# Altium project CoreBoard.PrjPcb
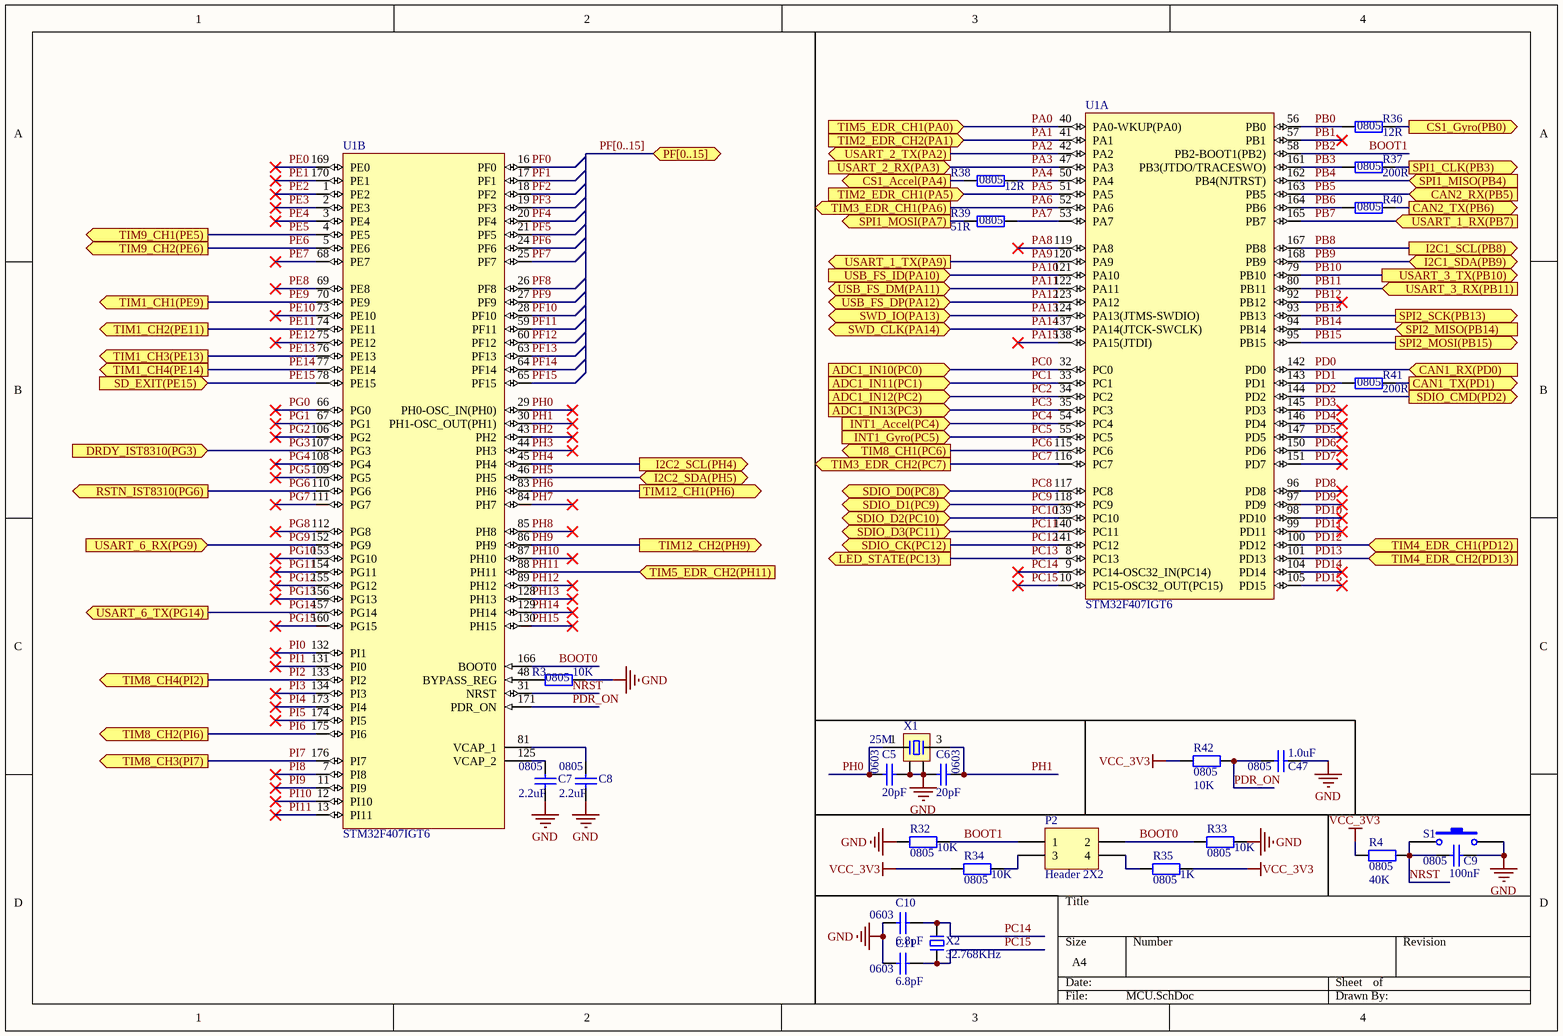
[diagram p0: MCU.SchDoc]
5 sheets, 296 parts. Net scope: flat (ports and power ports of the same name join across sheets).
Board files: coreBoard_autotrack.PcbDoc, coreBoard.PcbDoc
Sheets:
  MCU.SchDoc
  Power.SchDoc
  Interface1.SchDoc
  Sensor.SchDoc
  Interface2.SchDoc

## Sheet MCU.SchDoc
size A4

### Parts
C5  0603  value 20pF  [C 0603_L]
C6  0603  value 20pF  [C 0603_L]
C7  0805  value 2.2uF  [C 0805_M]
C8  0805  value 2.2uF  [C 0805_M]
C9  0805  value 100nF  [C 0805_M]
C10  0603  value 6.8pF  [C 0603_M]
C11  0603  value 6.8pF  [C 0603_L]
C47  0805  value 1.0uF  [C 0805_M]
P2  Header 2X2  [HDR2.54-LI-2x2P]
R3  0805  value 10K  [R 0805_L]
R4  0805  value 40K  [R 0805_L]
R32  0805  value 10K  [R 0805_L]
R33  0805  value 10K  [R 0805_L]
R34  0805  value 10K  [R 0805_L]
R35  0805  value 1K  [R 0805_L]
R36  0805  value 12R  [R 0805_L]
R37  0805  value 200R  [R 0805_L]
R38  0805  value 12R  [R 0805_L]
R39  0805  value 51R  [R 0805_L]
R40  0805  [R 0805_L]
R41  0805  value 200R  [R 0805_L]
R42  0805  value 10K  [R 0805_L]
S1  SW  [TSW DIP-3*6*4.3]  (value not drawn)
U1  STM32F407IGT6  [STM-LQFP176_N]  (parts A,B of 3)
X1  25M  [XTAL-3225]
X2  32.768KHz  [XTAL-3215A]

### Ports
ADC1_IN10(PC0) (in), ADC1_IN11(PC1) (in), ADC1_IN12(PC2) (in), ADC1_IN13(PC3) (in), CAN1_RX(PD0) (in), CAN1_TX(PD1) (out), CAN2_RX(PB5) (in), CAN2_TX(PB6) (out), CS1_Accel(PA4) (out), CS1_Gyro(PB0) (out), DRDY_IST8310(PG3) (in), I2C1_SCL(PB8) (out), I2C1_SDA(PB9) (bidir), I2C2_SCL(PH4) (out), I2C2_SDA(PH5) (bidir), INT1_Accel(PC4) (in), INT1_Gyro(PC5) (in), LED_STATE(PC13) (out), PF[0..15] (bidir), RSTN_IST8310(PG6) (out), SD_EXIT(PE15) (in), SDIO_CK(PC12) (out), SDIO_CMD(PD2) (out), SDIO_D0(PC8) (bidir), SDIO_D1(PC9) (bidir), SDIO_D2(PC10) (bidir), SDIO_D3(PC11) (bidir), SPI1_CLK(PB3) (out), SPI1_MISO(PB4) (in), SPI1_MOSI(PA7) (out), SPI2_MISO(PB14) (in), SPI2_MOSI(PB15) (out), SPI2_SCK(PB13) (out), SWD_CLK(PA14) (bidir), SWD_IO(PA13) (bidir), TIM1_CH1(PE9) (out), TIM1_CH2(PE11) (out), TIM1_CH3(PE13) (out), TIM1_CH4(PE14) (out), TIM2_EDR_CH1(PA5) (in), TIM2_EDR_CH2(PA1) (in), TIM3_EDR_CH1(PA6) (out), TIM3_EDR_CH2(PC7) (out), TIM4_EDR_CH1(PD12) (in), TIM4_EDR_CH2(PD13) (in), TIM5_EDR_CH1(PA0) (in), TIM5_EDR_CH2(PH11) (in), TIM8_CH1(PC6) (out), TIM8_CH2(PI6) (out), TIM8_CH3(PI7) (out), TIM8_CH4(PI2) (out), TIM9_CH1(PE5) (out), TIM9_CH2(PE6) (out), TIM12_CH1(PH6) (out), TIM12_CH2(PH9) (out), USART_1_RX(PB7) (in), USART_1_TX(PA9) (out), USART_2_RX(PA3) (in), USART_2_TX(PA2) (out), USART_3_RX(PB11) (in), USART_3_TX(PB10) (out), USART_6_RX(PG9) (in), USART_6_TX(PG14) (out), USB_FS_DM(PA11) (bidir), USB_FS_DP(PA12) (bidir), USB_FS_ID(PA10) (in)

### Nets
GND: C5.2 C6.1 C7.1 C8.1 C9.1 C10.1 C11.1 C47.1 R3.2 R32.1 R33.2 S1.2 X1.2 X1.4
VCC_3V3: R4.1 R34.1 R35.2 R42.1
BOOT0: P2.2 R33.1 U1.166(BOOT0)
BOOT1: P2.1 R32.2 U1.58(PB2-BOOT1(PB2))  [also labelled PB2]
NRST: C9.2 R4.2 S1.1 U1.31(NRST)
PA0: U1.40(PA0-WKUP(PA0)) ; port TIM5_EDR_CH1(PA0)
PA1: U1.41(PA1) ; port TIM2_EDR_CH2(PA1)
PA2: U1.42(PA2) ; port USART_2_TX(PA2)
PA3: U1.47(PA3) ; port USART_2_RX(PA3)
PA4: R38.2 U1.50(PA4)
PA5: U1.51(PA5) ; port TIM2_EDR_CH1(PA5)
PA6: U1.52(PA6) ; port TIM3_EDR_CH1(PA6)
PA7: R39.2 U1.53(PA7)
PA8: U1.119(PA8)
PA9: U1.120(PA9) ; port USART_1_TX(PA9)
PA10: U1.121(PA10) ; port USB_FS_ID(PA10)  [project net CC]
PA11: U1.122(PA11) ; port USB_FS_DM(PA11)
PA12: U1.123(PA12) ; port USB_FS_DP(PA12)
PA13: U1.124(PA13(JTMS-SWDIO)) ; port SWD_IO(PA13)
PA14: U1.137(PA14(JTCK-SWCLK)) ; port SWD_CLK(PA14)
PA15: U1.138(PA15(JTDI))
PB0: R36.1 U1.56(PB0)
PB1: U1.57(PB1)
PB3: R37.1 U1.161(PB3(JTDO/TRACESWO))
PB4: U1.162(PB4(NJTRST)) ; port SPI1_MISO(PB4)
PB5: U1.163(PB5) ; port CAN2_RX(PB5)
PB6: R40.1 U1.164(PB6)
PB7: U1.165(PB7) ; port USART_1_RX(PB7)
PB8: U1.167(PB8) ; port I2C1_SCL(PB8)
PB9: U1.168(PB9) ; port I2C1_SDA(PB9)
PB10: U1.79(PB10) ; port USART_3_TX(PB10)
PB11: U1.80(PB11) ; port USART_3_RX(PB11)
PB12: U1.92(PB12)
PB13: U1.93(PB13) ; port SPI2_SCK(PB13)
PB14: U1.94(PB14) ; port SPI2_MISO(PB14)
PB15: U1.95(PB15) ; port SPI2_MOSI(PB15)
PC0: U1.32(PC0) ; port ADC1_IN10(PC0)
PC1: U1.33(PC1) ; port ADC1_IN11(PC1)
PC2: U1.34(PC2) ; port ADC1_IN12(PC2)
PC3: U1.35(PC3) ; port ADC1_IN13(PC3)
PC4: U1.54(PC4) ; port INT1_Accel(PC4)
PC5: U1.55(PC5) ; port INT1_Gyro(PC5)
PC6: U1.115(PC6) ; port TIM8_CH1(PC6)
PC7: U1.116(PC7) ; port TIM3_EDR_CH2(PC7)
PC8: U1.117(PC8) ; port SDIO_D0(PC8)
PC9: U1.118(PC9) ; port SDIO_D1(PC9)
PC10: U1.139(PC10) ; port SDIO_D2(PC10)
PC11: U1.140(PC11) ; port SDIO_D3(PC11)
PC12: U1.141(PC12) ; port SDIO_CK(PC12)
PC13: U1.8(PC13) ; port LED_STATE(PC13)
PC14: C10.2 U1.9(PC14-OSC32_IN(PC14)) X2.2
PC15: C11.2 U1.10(PC15-OSC32_OUT(PC15)) X2.1
PD0: U1.142(PD0) ; port CAN1_RX(PD0)
PD1: R41.1 U1.143(PD1)
PD2: U1.144(PD2) ; port SDIO_CMD(PD2)
PD3: U1.145(PD3)
PD4: U1.146(PD4)
PD5: U1.147(PD5)
PD6: U1.150(PD6)
PD7: U1.151(PD7)
PD8: U1.96(PD8)
PD9: U1.97(PD9)
PD10: U1.98(PD10)
PD11: U1.99(PD11)
PD12: U1.100(PD12) ; port TIM4_EDR_CH1(PD12)
PD13: U1.101(PD13) ; port TIM4_EDR_CH2(PD13)
PD14: U1.104(PD14)
PD15: U1.105(PD15)
PDR_ON: C47.2 R42.2 U1.171(PDR_ON)
PE0: U1.169(PE0)
PE1: U1.170(PE1)
PE2: U1.1(PE2)
PE3: U1.2(PE3)
PE4: U1.3(PE4)
PE5: U1.4(PE5) ; port TIM9_CH1(PE5)
PE6: U1.5(PE6) ; port TIM9_CH2(PE6)
PE7: U1.68(PE7)
PE8: U1.69(PE8)
PE9: U1.70(PE9) ; port TIM1_CH1(PE9)
PE10: U1.73(PE10)
PE11: U1.74(PE11) ; port TIM1_CH2(PE11)
PE12: U1.75(PE12)
PE13: U1.76(PE13) ; port TIM1_CH3(PE13)
PE14: U1.77(PE14) ; port TIM1_CH4(PE14)
PE15: U1.78(PE15) ; port SD_EXIT(PE15)
PF0: U1.16(PF0)
PF1: U1.17(PF1)
PF2: U1.18(PF2)
PF3: U1.19(PF3)
PF4: U1.20(PF4)
PF5: U1.21(PF5)
PF6: U1.24(PF6)
PF7: U1.25(PF7)
PF8: U1.26(PF8)
PF9: U1.27(PF9)
PF10: U1.28(PF10)
PF11: U1.59(PF11)
PF12: U1.60(PF12)
PF13: U1.63(PF13)
PF14: U1.64(PF14)
PF15: U1.65(PF15)
PG0: U1.66(PG0)
PG1: U1.67(PG1)
PG2: U1.106(PG2)
PG3: U1.107(PG3) ; port DRDY_IST8310(PG3)
PG4: U1.108(PG4)
PG5: U1.109(PG5)
PG6: U1.110(PG6) ; port RSTN_IST8310(PG6)
PG7: U1.111(PG7)
PG8: U1.112(PG8)
PG9: U1.152(PG9) ; port USART_6_RX(PG9)
PG10: U1.153(PG10)
PG11: U1.154(PG11)
PG12: U1.155(PG12)
PG13: U1.156(PG13)
PG14: U1.157(PG14) ; port USART_6_TX(PG14)
PG15: U1.160(PG15)
PH0: C5.1 U1.29(PH0-OSC_IN(PH0)) X1.1
PH1: C6.2 U1.30(PH1-OSC_OUT(PH1)) X1.3
PH2: U1.43(PH2)
PH3: U1.44(PH3)
PH4: U1.45(PH4) ; port I2C2_SCL(PH4)
PH5: U1.46(PH5) ; port I2C2_SDA(PH5)
PH6: U1.83(PH6) ; port TIM12_CH1(PH6)
PH7: U1.84(PH7)
PH8: U1.85(PH8)
PH9: U1.86(PH9) ; port TIM12_CH2(PH9)
PH10: U1.87(PH10)
PH11: U1.88(PH11) ; port TIM5_EDR_CH2(PH11)
PH12: U1.89(PH12)
PH13: U1.128(PH13)
PH14: U1.129(PH14)
PH15: U1.130(PH15)
PI0: U1.132(PI1)
PI1: U1.131(PI0)
PI2: U1.133(PI2) ; port TIM8_CH4(PI2)
PI3: U1.134(PI3)
PI4: U1.173(PI4)
PI5: U1.174(PI5)
PI6: U1.175(PI6) ; port TIM8_CH2(PI6)
PI7: U1.176(PI7) ; port TIM8_CH3(PI7)
PI8: U1.7(PI8)
PI9: U1.11(PI9)
PI10: U1.12(PI10)
PI11: U1.13(PI11)
NetC7_2: C7.2 U1.125(VCAP_2)
NetC8_2: C8.2 U1.81(VCAP_1)
NetP2_3: P2.3 R34.2
NetP2_4: P2.4 R35.1
NetR3_1: R3.1 U1.48(BYPASS_REG)
NetR36_2: R36.2 ; port CS1_Gyro(PB0)
NetR37_2: R37.2 ; port SPI1_CLK(PB3)
NetR38_1: R38.1 ; port CS1_Accel(PA4)
NetR39_1: R39.1 ; port SPI1_MOSI(PA7)
NetR40_2: R40.2 ; port CAN2_TX(PB6)
NetR41_2: R41.2 ; port CAN1_TX(PD1)

### Buses and harness runs
bus PF[0..15] = port PF[0..15]

### Library data of the parts
C5-C11 C47 = CAP
P2 = Header 2X2: Header, 2-Pin, Dual row; LatestRevisionDate: 17-Jul-2002; LatestRevisionNote: Re-released for DXP Platform.; Publisher: Altium Limited
R3 R4 R32-R42 = RES2: Resistor; Published: 8-Jun-2000; LatestRevisionDate: 17-Jul-2002; LatestRevisionNote: Re-released for DXP Platform.; PackageReference: AXIAL-0.3; Publisher: Altium Limited; PackageDescription: Axial Device, Thru-Hole; 2 Leads; 0.3 in Pin Spacing
U1 = STM32F407IGT6: ARM Cortex-M4 32-bit MCU+FPU, 210 DMIPS, 1024 kB Flash, 192 kB Internal RAM, 140 I/Os, 176-pin LQFP, -40 to 85 degC, Tray; Manufacturer: STMicroelectronics; D/A Converter: 2x12-bit; FLASH Size (Prog) (kB): 1024; I/Os (High Current): 140; Internal RAM Size (kB): 192; Operating Frequency(F) (Processor speed) (MHz): 168; Supply Voltage(Vcc) max (V): 3.6; Supply Voltage(Vcc) min (V): 1.8; DatasheetVersion: Rev. 4; PackageVersion: Rev. 4, 06/2013; PackageReference: LQFP176; PackageDescription: 176-Pin Low Profile Quad Flat Package, 24 x 24 mm Body, 0.5 mm Pitch; Supplier 1: Digi-Key; Supplier Part Number 1: 497-11604-ND; Supplier 2: Farnell; Supplier Part Number 2: 2064366; Supplier 3: Newark; Supplier Part Number 3: 73T2331; Supplier 4: Mouser; Supplier Part Number 4: 511-STM32F407IGT6; Core: ARM Cortex-M4; Packing: Tray; Mounting Technology: Surface Mount; PartNumber: STM32F407IGT6; ComponentLink1Description: Manufacturer URL; ComponentLink1URL: http://www.st.com/web/en/home.html; ComponentLink2Description: Datasheet; ComponentLink2URL: http://www.st.com/st-web-ui/static/active/en/resource/technical/document/datasheet/DM00037051.pdf; ComponentLink3Description: Package Specification; ComponentLink3URL: http://www.st.com/st-web-ui/static/active/en/resource/technical/document/datasheet/DM00035129.pdf
X1 = XTAL-4: 4脚晶振; 版权归属: 源创客; BOM名称: 4脚晶振; 学习资源: www.ooocke.com
X2 = XTAL-2: 2脚晶振; 版权归属: 源创客; BOM名称: 2脚晶振; 学习资源: www.ooocke.com
S1 = SW: Published: 24-Mar-1999; LatestRevisionDate: 17-Jul-2002; LatestRevisionNote: Re-released for DXP Platform.; Publisher: Altium Limited

## Sheet Power.SchDoc
size A4
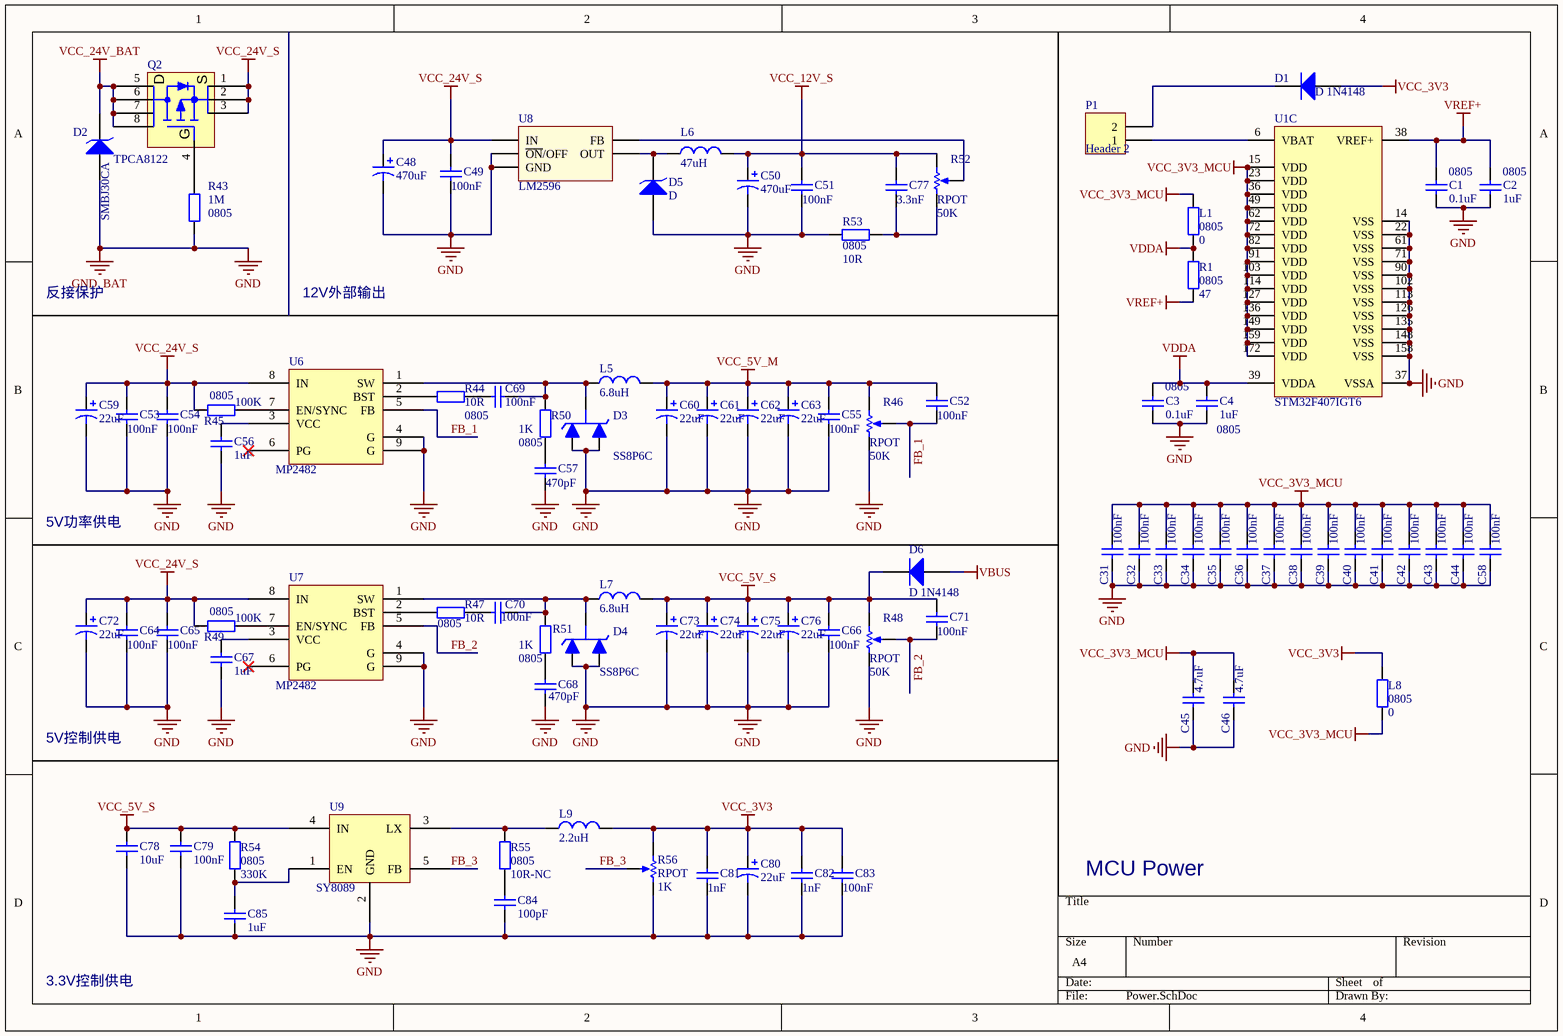
[diagram p1: Power.SchDoc]

### Parts
C1  0805  value 0.1uF  [C 0603_L]
C2  0805  value 1uF  [C 0603_L]
C3  0805  value 0.1uF  [C 0603_L]
C4  0805  value 1uF  [C 0603_L]
C31  value 100nF  [C 0603_L]  (hidden comment: 0805)
C32  value 100nF  [C 0603_L]  (hidden comment: 0805)
C33  value 100nF  [C 0603_L]  (hidden comment: 0805)
C34  value 100nF  [C 0603_L]  (hidden comment: 0805)
C35  value 100nF  [C 0603_L]  (hidden comment: 0805)
C36  value 100nF  [C 0603_L]  (hidden comment: 0805)
C37  value 100nF  [C 0603_L]  (hidden comment: 0805)
C38  value 100nF  [C 0603_L]  (hidden comment: 0805)
C39  value 100nF  [C 0603_L]  (hidden comment: 0805)
C40  value 100nF  [C 0603_L]  (hidden comment: 0805)
C41  value 100nF  [C 0603_L]  (hidden comment: 0805)
C42  value 100nF  [C 0603_L]  (hidden comment: 0805)
C43  value 100nF  [C 0603_L]  (hidden comment: 0805)
C44  value 100nF  [C 0603_L]  (hidden comment: 0805)
C45  value 4.7uF  [C 0805_M]  (hidden comment: 0805)
C46  value 4.7uF  [C 0805_M]  (hidden comment: 0805)
C48  value 470uF  [CM E(8*10.2)]  (hidden comment: CAP-ELEC)
C49  value 100nF  [C 0805_L]  (hidden comment: CAP)
C50  value 470uF  [CM E(8*10.2)]  (hidden comment: CAP-ELEC)
C51  value 100nF  [C 0805_L]  (hidden comment: CAP)
C52  value 100nF  [C 0805_L]  (hidden comment: CAP)
C53  value 100nF  [C 0805_L]  (hidden comment: CAP)
C54  value 100nF  [C 0805_L]  (hidden comment: CAP)
C55  value 100nF  [C 0805_L]  (hidden comment: CAP)
C56  value 1uF  [C 0805_L]  (hidden comment: CAP)
C57  value 470pF  [C 0805_L]  (hidden comment: CAP)
C58  value 100nF  [C 0603_L]  (hidden comment: 0805)
C59  value 22uF  [CD C(6032)]  (hidden comment: CAP-ELEC)
C60  value 22uF  [CD C(6032)]  (hidden comment: CAP-ELEC)
C61  value 22uF  [CD C(6032)]  (hidden comment: CAP-ELEC)
C62  value 22uF  [CD C(6032)]  (hidden comment: CAP-ELEC)
C63  value 22uF  [CD C(6032)]  (hidden comment: CAP-ELEC)
C64  value 100nF  [C 0805_L]  (hidden comment: CAP)
C65  value 100nF  [C 0805_L]  (hidden comment: CAP)
C66  value 100nF  [C 0805_L]  (hidden comment: CAP)
C67  value 1uF  [C 0805_L]  (hidden comment: CAP)
C68  value 470pF  [C 0805_L]  (hidden comment: CAP)
C69  value 100nF  [C 0805_L]  (hidden comment: CAP)
C70  value 100nF  [C 0805_L]  (hidden comment: CAP)
C71  value 100nF  [C 0805_L]  (hidden comment: CAP)
C72  value 22uF  [CD C(6032)]  (hidden comment: CAP-ELEC)
C73  value 22uF  [CD C(6032)]  (hidden comment: CAP-ELEC)
C74  value 22uF  [CD C(6032)]  (hidden comment: CAP-ELEC)
C75  value 22uF  [CD C(6032)]  (hidden comment: CAP-ELEC)
C76  value 22uF  [CD C(6032)]  (hidden comment: CAP-ELEC)
C77  value 3.3nF  [C 0805_L]  (hidden comment: CAP)
C78  value 10uF  [C 0805_L]  (hidden comment: CAP)
C79  value 100nF  [C 0805_L]  (hidden comment: CAP)
C80  value 22uF  [CD C(6032)]  (hidden comment: CAP-ELEC)
C81  value 1nF  [C 0805_L]  (hidden comment: CAP)
C82  value 1nF  [C 0805_L]  (hidden comment: CAP)
C83  value 100nF  [C 0805_L]  (hidden comment: CAP)
C84  value 100pF  [C 0805_L]  (hidden comment: CAP)
C85  value 1uF  [C 0805_L]  (hidden comment: CAP)
D1  D 1N4148  [SOD-523]
D2  SMBJ30CA  [SMB]
D3  SS8P6C  [TO-277]
D4  SS8P6C  [TO-277]
D5  D  [SOD-123]
D6  D 1N4148  [SOD-123]
L1  0805  value 0  [R 0402_L]
L5  value 6.8uH  [L-SMD-10]  (hidden comment: Inductor)
L6  value 47uH  [L-SMD-12]  (hidden comment: Inductor)
L7  value 6.8uH  [L-SMD-10]  (hidden comment: Inductor)
L8  0805  value 0  [R 0402_L]
L9  value 2.2uH  [CD52]  (hidden comment: Inductor)
P1  Header 2  [HDR2.54-LI-2P]
Q2  TPCA8122  [PSOP8]
R1  0805  value 47  [R 0402_L]
R43  0805  value 1M  [R 0805_L]
R44  0805  value 10R  [R 0805_L]
R45  0805  value 100K  [R 0805_L]
R46  RPOT  value 50K  [3296W]
R47  0805  value 10R  [R 0805_L]
R48  RPOT  value 50K  [3296W]
R49  0805  value 100K  [R 0805_L]
R50  0805  value 1K  [R 0805_L]
R51  0805  value 1K  [R 0805_L]
R52  RPOT  value 50K  [3296W]
R53  0805  value 10R  [R 0805_L]
R54  0805  value 330K  [R 0805_L]
R55  0805  value 10R-NC  [R 0805_L]
R56  RPOT  value 1K  [3296W]
U1  STM32F407IGT6  [STM-LQFP176_N]  (part C of 3)
U6  MP2482  [SOIC9N]
U7  MP2482  [SOIC9N]
U8  LM2596  [TO263-5A]
U9  SY8089  [SOT-23-5L]

### Nets
GND: C1.1 C2.1 C3.1 C4.1 C31.1 C32.1 C33.1 C34.1 C35.1 C36.1 C37.1 C38.1 C39.1 C40.1 C41.1 C42.1 C43.1 C44.1 C45.1 C46.1 C48.2 C49.2 C50.2 C51.2 C53.2 C54.2 C55.2 C56.1 C57.1 C58.1 C59.2 C60.2 C61.2 C62.2 C63.2 C64.2 C65.2 C66.2 C67.1 C68.1 C72.2 C73.2 C74.2 C75.2 C76.2 C78.1 C79.1 C80.2 C81.2 C82.2 C83.2 C84.1 C85.1 D2.1(A) D3.1 D3.2 D4.1 D4.2 D5.1(A) R43.1 R46.1 R48.1 R53.2 R56.3 U1.14(VSS) U1.22(VSS) U1.37(VSSA) U1.61(VSS) U1.71(VSS) U1.90(VSS) U1.102(VSS) U1.113(VSS) U1.126(VSS) U1.135(VSS) U1.148(VSS) U1.158(VSS) U6.4(G) U6.9(G) U7.4(G) U7.9(G) U8.3(GND) U8.5(~{ON}/OFF) U9.2(GND)  [also labelled GND_BAT]
VBUS: D6.1(A)
VCC_3V3: C80.1 C81.1 C82.1 C83.1 D1.1(A) L8.2 L9.2 R56.1
VCC_3V3_MCU: C31.2 C32.2 C33.2 C34.2 C35.2 C36.2 C37.2 C38.2 C39.2 C40.2 C41.2 C42.2 C43.2 C44.2 C45.2 C46.2 C58.2 L1.2 L8.1 U1.15(VDD) U1.23(VDD) U1.36(VDD) U1.49(VDD) U1.62(VDD) U1.72(VDD) U1.82(VDD) U1.91(VDD) U1.103(VDD) U1.114(VDD) U1.127(VDD) U1.136(VDD) U1.149(VDD) U1.159(VDD) U1.172(VDD)
VCC_5V_M: C52.1 C55.1 C60.1 C61.1 C62.1 C63.1 L5.2 R46.3
VCC_5V_S: C66.1 C71.1 C73.1 C74.1 C75.1 C76.1 C78.2 C79.2 D6.2(K) L7.2 R48.3 R54.2 U9.4(IN)
VCC_12V_S: C50.1 C51.1 C77.1 L6.2 R52.3
VCC_24V_BAT: D2.2(K) Q2.5 Q2.6 Q2.7 Q2.8
VCC_24V_S: C48.1 C49.1 C53.1 C54.1 C59.1 C64.1 C65.1 C72.1 Q2.1(S) Q2.2(S) Q2.3(S) R45.1 R49.1 U6.8(IN) U7.8(IN) U8.1(IN)
VDDA: C3.2 C4.2 L1.1 R1.2 U1.39(VDDA)
VREF+: C1.2 C2.2 R1.1 U1.38(VREF+)
FB_1: C52.2 R46.2 U6.5(FB)
FB_2: C71.2 R48.2 U7.5(FB)
FB_3: R56.2 U9.5(FB)
NetC56_2: C56.2 U6.3(VCC)
NetC57_2: C57.2 R50.1
NetC67_2: C67.2 U7.3(VCC)
NetC68_2: C68.2 R51.1
NetC69_1: C69.1 D3.3 L5.1 R50.2 U6.1(SW)
NetC69_2: C69.2 R44.2
NetC70_1: C70.1 D4.3 L7.1 R51.2 U7.1(SW)
NetC70_2: C70.2 R47.2
NetC77_2: C77.2 R52.1 R53.1
NetC84_2: C84.2 R55.1
NetC85_2: C85.2 R54.1 U9.1(EN)
NetD1_2: D1.2(K) P1.2
NetD5_2: D5.2(K) L6.1 U8.2(OUT)
NetL9_1: L9.1 R55.2 U9.3(LX)
NetP1_1: P1.1 U1.6(VBAT)
NetQ2_4: Q2.4(G) R43.2
NetR44_1: R44.1 U6.2(BST)
NetR45_2: R45.2 U6.7(EN/SYNC)
NetR47_1: R47.1 U7.2(BST)
NetR49_2: R49.2 U7.7(EN/SYNC)
NetR52_2: R52.2 U8.4(FB)

Not connected (* = marked no-connect by the designer): U6 6(PG)*; U7 6(PG)*

### Notes on the sheet
- 反接保护
- 12V外部输出
- 5V功率供电
- 5V控制供电
- MCU Power
- 3.3V控制供电
- (in symbol TPCA8122) D

### Library data of the parts
C1-C4 C31-C46 C58 = CAP
D1 D6 = D 1N4148: High Conductance Fast Diode; Published: 8-Jun-2000; LatestRevisionDate: 17-Jul-2002; LatestRevisionNote: Re-released for DXP Platform.; DatasheetVersion: 1997; PackageReference: DO-35; Publisher: Altium Limited; PackageDescription: Diode, Axial; Body 3.8 x 1.9 mm (LxDia. max), Lead Dia. 0.53 mm (max); Code_JEDEC: DO-204-AH; ComponentLink1Description: Manufacturer Link; ComponentLink1URL: http://www.fairchildsemi.com/; ComponentLink2Description: Datasheet; ComponentLink2URL: http://www.fairchildsemi.com/ds/1N%2F1N4148.pdf
D2 D5 = D: High Conductance Fast Diode; Published: 8-Jun-2000; LatestRevisionDate: 17-Jul-2002; LatestRevisionNote: Re-released for DXP Platform.; DatasheetVersion: 1997; PackageReference: DO-35; Publisher: Altium Limited; PackageDescription: Diode, Axial; Body 3.8 x 1.9 mm (LxDia. max), Lead Dia. 0.53 mm (max); Code_JEDEC: DO-204-AH; ComponentLink1Description: Manufacturer Link; ComponentLink1URL: http://www.fairchildsemi.com/; ComponentLink2Description: Datasheet; ComponentLink2URL: http://www.fairchildsemi.com/ds/1N%2F1N4148.pdf
L1 L8 R1 R43-R45 R47 R49-R51 R53-R55 = RES2: Resistor; Published: 8-Jun-2000; LatestRevisionDate: 17-Jul-2002; LatestRevisionNote: Re-released for DXP Platform.; PackageReference: AXIAL-0.3; Publisher: Altium Limited; PackageDescription: Axial Device, Thru-Hole; 2 Leads; 0.3 in Pin Spacing
L5-L7 L9 = Inductor: 电感; Code_IEC: 1005; Published: 8-Jun-2000; LatestRevisionDate: 17-Jul-2002; LatestRevisionNote: Re-released for DXP Platform.; PackageReference: 0402-A; Publisher: Altium Limited; Code_JEITA: 0402
P1 = Header 2: Header, 2-Pin; LatestRevisionDate: 17-Jul-2002; LatestRevisionNote: Re-released for DXP Platform.; Publisher: Altium Limited
R46 R48 R52 R56 = RPOT: Potentiometer; Sim Note: Enter the Resistance value and the set point into parameter fields.; Set Position: 0.5; Published: 8-Jun-2000; LatestRevisionDate: 17-Jul-2002; LatestRevisionNote: Re-released for DXP Platform.; PackageReference: VR5; Publisher: Altium Limited; PackageDescription: Variable Resistor, Thru-Hole; 3 Leads
U1 = STM32F407IGT6: as U1 on sheet MCU; DatasheetVersion: Rev. 4; PackageVersion: Rev. 4, 06/2013; PackageReference: LQFP176; PackageDescription: 176-Pin Low Profile Quad Flat Package, 24 x 24 mm Body, 0.5 mm Pitch; Supplier 1: Digi-Key; Supplier Part Number 1: 497-11604-ND; Supplier 2: Farnell; Supplier Part Number 2: 2064366; Supplier 3: Newark; Supplier Part Number 3: 73T2331; Supplier 4: Mouser; Supplier Part Number 4: 511-STM32F407IGT6; Core: ARM Cortex-M4; Packing: Tray; Mounting Technology: Surface Mount; PartNumber: STM32F407IGT6; ComponentLink1Description: Manufacturer URL; ComponentLink1URL: http://www.st.com/web/en/home.html; ComponentLink2Description: Datasheet; ComponentLink2URL: http://www.st.com/st-web-ui/static/active/en/resource/technical/document/datasheet/DM00037051.pdf; ComponentLink3Description: Package Specification; ComponentLink3URL: http://www.st.com/st-web-ui/static/active/en/resource/technical/document/datasheet/DM00035129.pdf
U8 = LM2576S

## Sheet Interface1.SchDoc
size A4
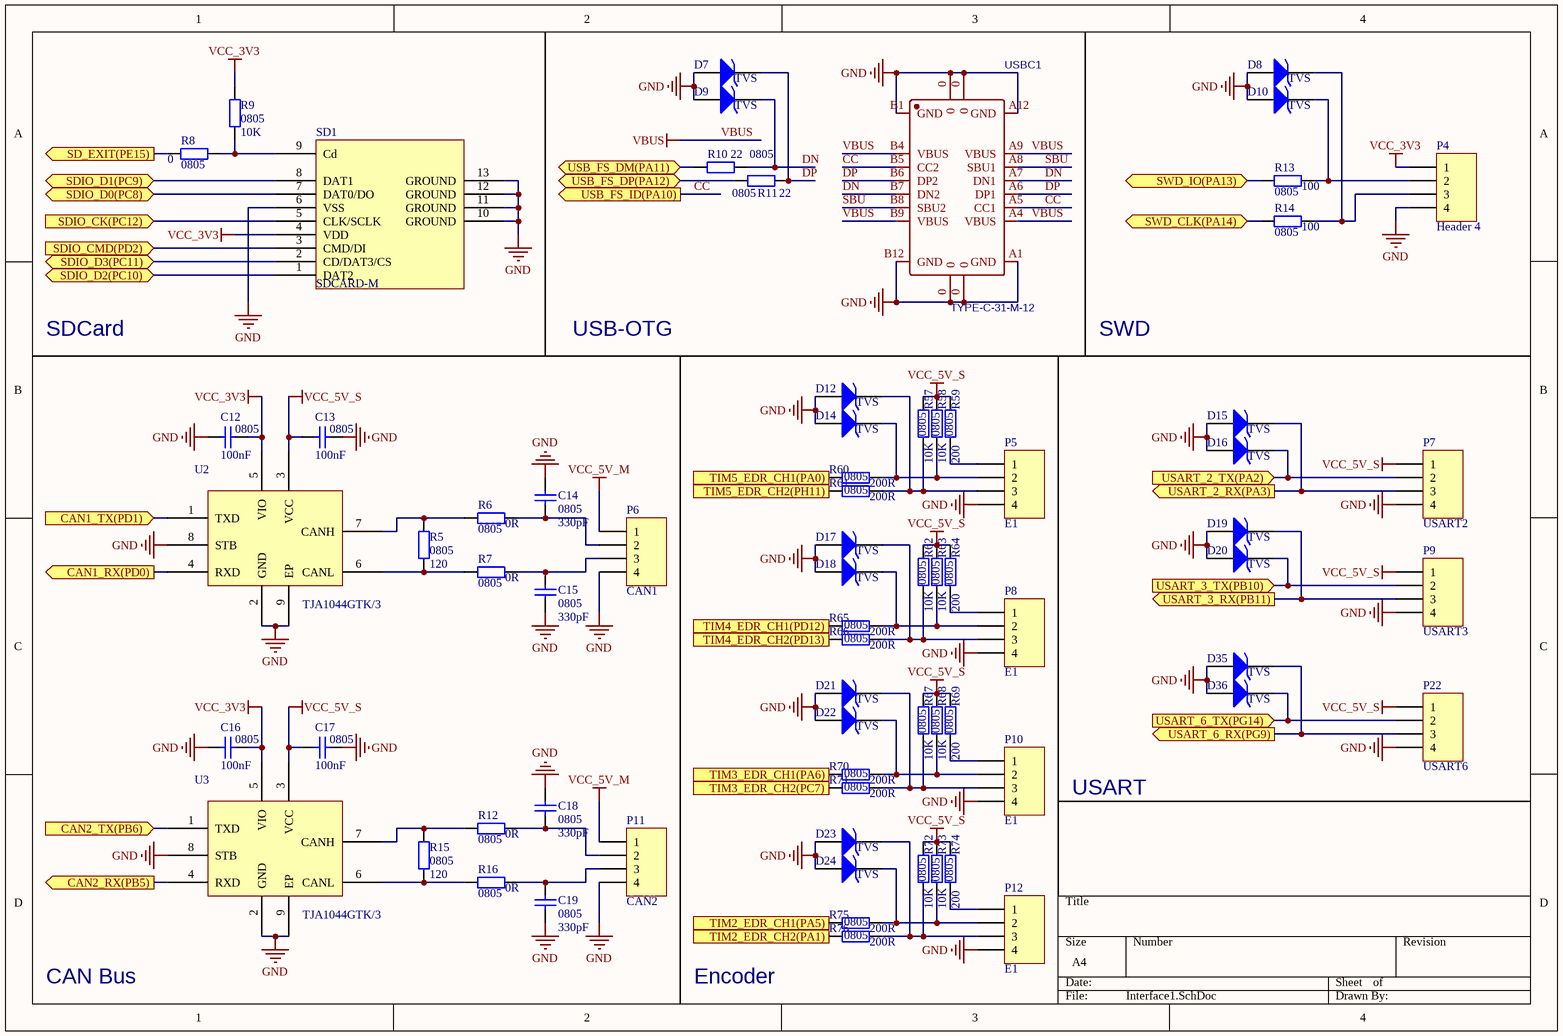
[diagram p2: Interface1.SchDoc]

### Parts
C12  0805  value 100nF  [C 0805_M]
C13  0805  value 100nF  [C 0805_M]
C14  0805  value 330pF  [C 0805_M]
C15  0805  value 330pF  [C 0805_M]
C16  0805  value 100nF  [C 0805_M]
C17  0805  value 100nF  [C 0805_M]
C18  0805  value 330pF  [C 0805_M]
C19  0805  value 330pF  [C 0805_M]
D7  TVS  [SOD-523]
D8  TVS  [SOD-523]
D9  TVS  [SOD-523]
D10  TVS  [SOD-523]
D12  TVS  [SOD-523]
D14  TVS  [SOD-523]
D15  TVS  [SOD-523]
D16  TVS  [SOD-523]
D17  TVS  [SOD-523]
D18  TVS  [SOD-523]
D19  TVS  [SOD-523]
D20  TVS  [SOD-523]
D21  TVS  [SOD-523]
D22  TVS  [SOD-523]
D23  TVS  [SOD-523]
D24  TVS  [SOD-523]
D35  TVS  [SOD-523]
D36  TVS  [SOD-523]
P4  Header 4  [HDR2.54-LI-4P]
P5  E1  [HDR2.54-LI-4P]
P6  CAN1  [HDR2.54-LI-4P]
P7  USART2  [HDR2.54-LI-4P]
P8  E1  [HDR2.54-LI-4P]
P9  USART3  [HDR2.54-LI-4P]
P10  E1  [HDR2.54-LI-4P]
P11  CAN2  [HDR2.54-LI-4P]
P12  E1  [HDR2.54-LI-4P]
P22  USART6  [HDR2.54-LI-4P]
R5  0805  value 120  [R 0805_L]
R6  0805  value 0R  [R 0805_L]
R7  0805  value 0R  [R 0805_L]
R8  0805  value 0  [R 0805_L]
R9  0805  value 10K  [R 0805_L]
R10  0805  value 22  [R 0805_L]
R11  0805  value 22  [R 0805_L]
R12  0805  value 0R  [R 0805_L]
R13  0805  value 100  [R 0805_L]
R14  0805  value 100  [R 0805_L]
R15  0805  value 120  [R 0805_L]
R16  0805  value 0R  [R 0805_L]
R57  0805  value 10K  [R 0805_L]
R58  0805  value 10K  [R 0805_L]
R59  0805  value 200  [R 0805_L]
R60  0805  value 200R  [R 0805_L]
R61  0805  value 200R  [R 0805_L]
R62  0805  value 10K  [R 0805_L]
R63  0805  value 10K  [R 0805_L]
R64  0805  value 200  [R 0805_L]
R65  0805  value 200R  [R 0805_L]
R66  0805  value 200R  [R 0805_L]
R67  0805  value 10K  [R 0805_L]
R68  0805  value 10K  [R 0805_L]
R69  0805  value 200  [R 0805_L]
R70  0805  value 200R  [R 0805_L]
R71  0805  value 200R  [R 0805_L]
R72  0805  value 10K  [R 0805_L]
R73  0805  value 10K  [R 0805_L]
R74  0805  value 200  [R 0805_L]
R75  0805  value 200R  [R 0805_L]
R76  0805  value 200R  [R 0805_L]
SD1  SDCARD-M  [SDCARD-M]
U2  TJA1044GTK/3  [HVSON8]
U3  TJA1044GTK/3  [HVSON8]
USBC1  TYPE-C-31-M-12  [TYPE-C-USB-17]

### Ports
CAN1_RX(PD0) (out), CAN1_TX(PD1) (in), CAN2_RX(PB5) (out), CAN2_TX(PB6) (in), SD_EXIT(PE15) (out), SDIO_CK(PC12) (in), SDIO_CMD(PD2) (in), SDIO_D0(PC8) (bidir), SDIO_D1(PC9) (bidir), SDIO_D2(PC10) (bidir), SDIO_D3(PC11) (bidir), SWD_CLK(PA14) (bidir), SWD_IO(PA13) (bidir), TIM2_EDR_CH1(PA5) (out), TIM2_EDR_CH2(PA1) (out), TIM3_EDR_CH1(PA6) (out), TIM3_EDR_CH2(PC7) (out), TIM4_EDR_CH1(PD12) (out), TIM4_EDR_CH2(PD13) (out), TIM5_EDR_CH1(PA0) (out), TIM5_EDR_CH2(PH11) (out), USART_2_RX(PA3) (out), USART_2_TX(PA2) (in), USART_3_RX(PB11) (out), USART_3_TX(PB10) (in), USART_6_RX(PG9) (out), USART_6_TX(PG14) (in), USB_FS_DM(PA11) (bidir), USB_FS_DP(PA12) (bidir), USB_FS_ID(PA10) (out)

### Nets
GND: C12.1 C13.2 C14.2 C15.1 C16.1 C17.2 C18.2 C19.1 D7.1(A) D8.1(A) D9.1(A) D10.1(A) D12.1(A) D14.1(A) D15.1(A) D16.1(A) D17.1(A) D18.1(A) D19.1(A) D20.1(A) D21.1(A) D22.1(A) D23.1(A) D24.1(A) D35.1(A) D36.1(A) P4.4 P5.4 P6.4 P7.4 P8.4 P9.4 P10.4 P11.4 P12.4 P22.4 SD1.6(VSS) SD1.10(GROUND) SD1.11(GROUND) SD1.12(GROUND) SD1.13(GROUND) U2.2(GND) U2.8(STB) U2.9(EP) U3.2(GND) U3.8(STB) U3.9(EP) USBC1.0 USBC1.A1(GND) USBC1.A12(GND) USBC1.B1(GND) USBC1.B12(GND)
VBUS: USBC1.A4(VBUS) USBC1.A9(VBUS) USBC1.B4(VBUS) USBC1.B9(VBUS)
VCC_3V3: C12.2 C16.2 P4.1 R9.2 SD1.4(VDD) U2.5(VIO) U3.5(VIO)
VCC_5V_M: P6.1 P11.1
VCC_5V_S: C13.1 C17.1 P7.1 P9.1 P22.1 R57.2 R58.2 R59.2 R62.2 R63.2 R64.2 R67.2 R68.2 R69.2 R72.2 R73.2 R74.2 U2.3(VCC) U3.3(VCC)
CC: USBC1.A5(CC1) USBC1.B5(CC2) ; port USB_FS_ID(PA10)
DN: D9.2(K) R10.2 USBC1.A7(DN1) USBC1.B7(DN2)
DP: D7.2(K) R11.2 USBC1.A6(DP1) USBC1.B6(DP2)
PA0: R60.1 ; port TIM5_EDR_CH1(PA0)
PA1: R76.1 ; port TIM2_EDR_CH2(PA1)
PA2: D16.2(K) P7.2 ; port USART_2_TX(PA2)
PA3: D15.2(K) P7.3 ; port USART_2_RX(PA3)
PA5: R75.1 ; port TIM2_EDR_CH1(PA5)
PA6: R70.1 ; port TIM3_EDR_CH1(PA6)
PA11: R10.1 ; port USB_FS_DM(PA11)
PA12: R11.1 ; port USB_FS_DP(PA12)
PA13: R13.1 ; port SWD_IO(PA13)
PA14: R14.1 ; port SWD_CLK(PA14)
PB5: U3.4(RXD) ; port CAN2_RX(PB5)
PB10: D20.2(K) P9.2 ; port USART_3_TX(PB10)
PB11: D19.2(K) P9.3 ; port USART_3_RX(PB11)
PC7: R71.1 ; port TIM3_EDR_CH2(PC7)
PC8: SD1.7(DAT0/DO) ; port SDIO_D0(PC8)
PC9: SD1.8(DAT1) ; port SDIO_D1(PC9)
PC10: SD1.1(DAT2) ; port SDIO_D2(PC10)
PC11: SD1.2(CD/DAT3/CS) ; port SDIO_D3(PC11)
PC12: SD1.5(CLK/SCLK) ; port SDIO_CK(PC12)
PD0: U2.4(RXD) ; port CAN1_RX(PD0)
PD2: SD1.3(CMD/DI) ; port SDIO_CMD(PD2)
PD12: R65.1 ; port TIM4_EDR_CH1(PD12)
PD13: R66.1 ; port TIM4_EDR_CH2(PD13)
PE15: R8.1 ; port SD_EXIT(PE15)
PG9: D35.2(K) P22.3 ; port USART_6_RX(PG9)
PG14: D36.2(K) P22.2 ; port USART_6_TX(PG14)
PH11: R61.1 ; port TIM5_EDR_CH2(PH11)
SBU: USBC1.A8(SBU1) USBC1.B8(SBU2)
NetC14_1: C14.1 P6.2 R6.1
NetC15_2: C15.2 P6.3 R7.1
NetC18_1: C18.1 P11.2 R12.1
NetC19_2: C19.2 P11.3 R16.1
NetD8_2: D8.2(K) P4.3 R14.2
NetD10_2: D10.2(K) P4.2 R13.2
NetD12_2: D12.2(K) P5.3 R57.1 R61.2
NetD14_2: D14.2(K) P5.2 R58.1 R60.2
NetD17_2: D17.2(K) P8.3 R62.1 R66.2
NetD18_2: D18.2(K) P8.2 R63.1 R65.2
NetD21_2: D21.2(K) P10.3 R67.1 R71.2
NetD22_2: D22.2(K) P10.2 R68.1 R70.2
NetD23_2: D23.2(K) P12.3 R72.1 R76.2
NetD24_2: D24.2(K) P12.2 R73.1 R75.2
NetP5_1: P5.1 R59.1
NetP8_1: P8.1 R64.1
NetP10_1: P10.1 R69.1
NetP12_1: P12.1 R74.1
NetR5_1: R5.1 R7.2 U2.6(CANL)
NetR5_2: R5.2 R6.2 U2.7(CANH)
NetR8_2: R8.2 R9.1 SD1.9(Cd)
NetR12_2: R12.2 R15.2 U3.7(CANH)
NetR15_1: R15.1 R16.2 U3.6(CANL)
NetR40_2: U3.1(TXD) ; port CAN2_TX(PB6)
NetR41_2: U2.1(TXD) ; port CAN1_TX(PD1)

### Notes on the sheet
- SDCard
- USB-OTG
- SWD
- USART
- CAN Bus
- Encoder

### Library data of the parts
C12-C19 = CAP
D7-D10 D12 D14-D24 D35 D36 = D: High Conductance Fast Diode; Published: 8-Jun-2000; LatestRevisionDate: 17-Jul-2002; LatestRevisionNote: Re-released for DXP Platform.; DatasheetVersion: 1997; PackageReference: DO-35; Publisher: Altium Limited; PackageDescription: Diode, Axial; Body 3.8 x 1.9 mm (LxDia. max), Lead Dia. 0.53 mm (max); Code_JEDEC: DO-204-AH; ComponentLink1Description: Manufacturer Link; ComponentLink1URL: http://www.fairchildsemi.com/; ComponentLink2Description: Datasheet; ComponentLink2URL: http://www.fairchildsemi.com/ds/1N%2F1N4148.pdf
P4-P12 P22 = Header 4: Header, 4-Pin; LatestRevisionDate: 17-Jul-2002; LatestRevisionNote: Re-released for DXP Platform.; Publisher: Altium Limited
R5-R16 R57-R76 = RES2: Resistor; Published: 8-Jun-2000; LatestRevisionDate: 17-Jul-2002; LatestRevisionNote: Re-released for DXP Platform.; PackageReference: AXIAL-0.3; Publisher: Altium Limited; PackageDescription: Axial Device, Thru-Hole; 2 Leads; 0.3 in Pin Spacing
SD1 = SDCARD-M: TF卡槽

## Sheet Sensor.SchDoc
size A4
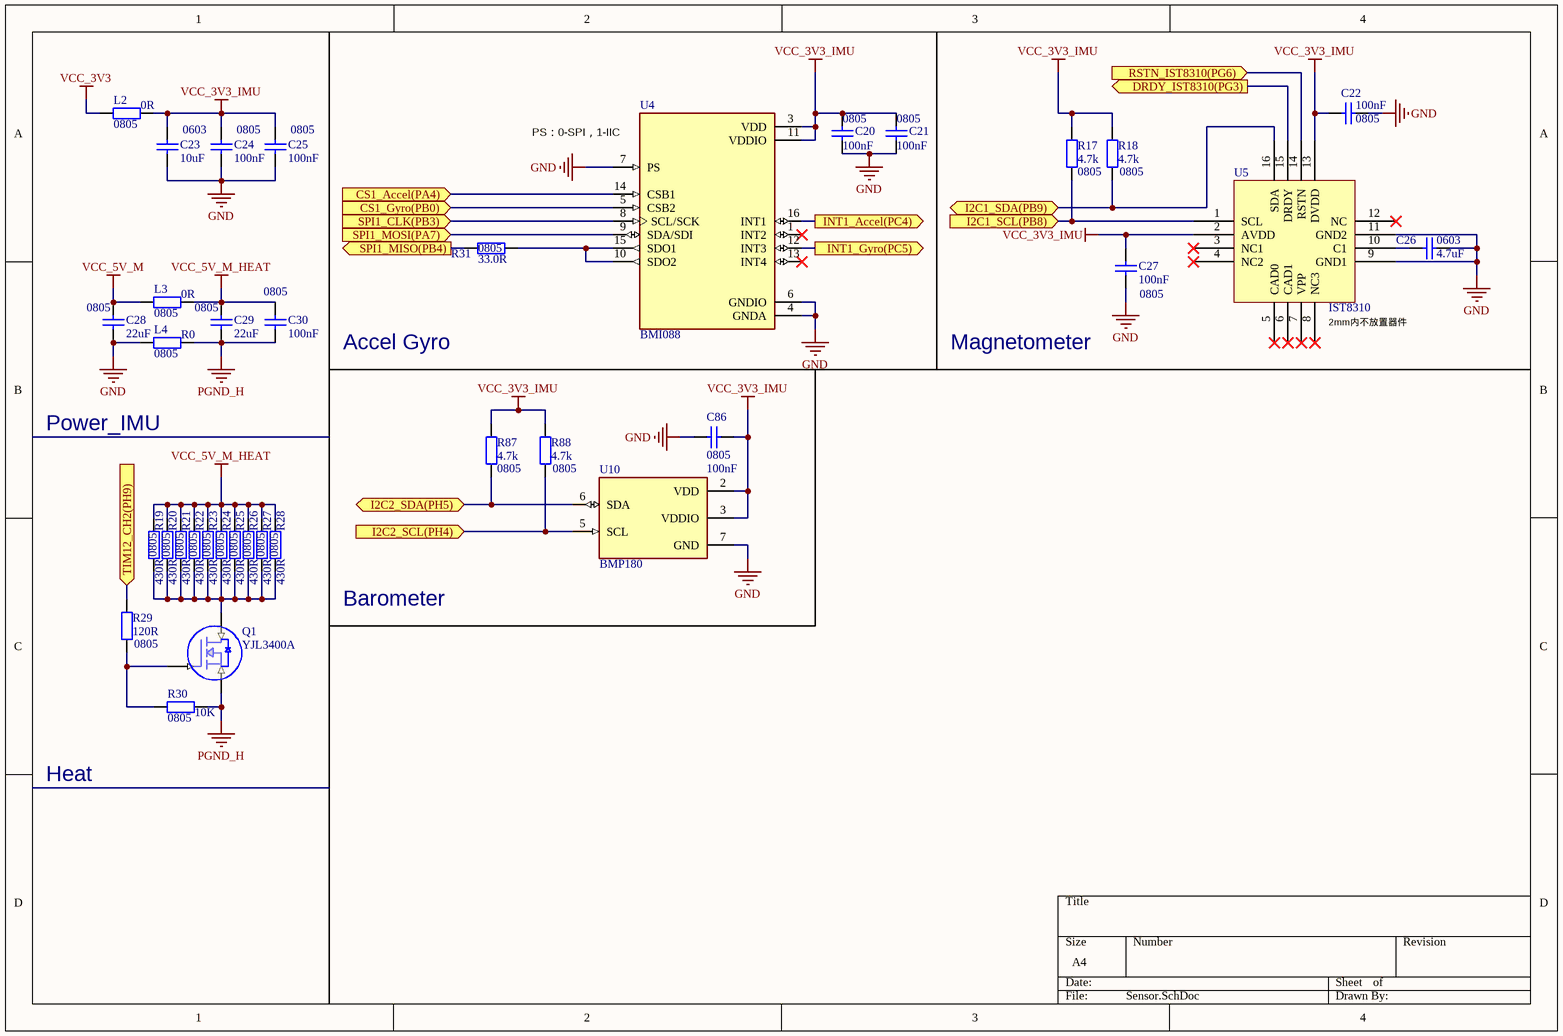
[diagram p3: Sensor.SchDoc]

### Parts
C20  0805  value 100nF  [C 0805_M]
C21  0805  value 100nF  [C 0805_M]
C22  0805  value 100nF  [C 0805_M]
C23  0603  value 10uF  [C 0603_L]
C24  0805  value 100nF  [C 0805_M]
C25  0805  value 100nF  [C 0805_M]
C26  0603  value 4.7uF  [C 0603_M]
C27  0805  value 100nF  [C 0805_M]
C28  0805  value 22uF  [C 0805_L]
C29  0805  value 22uF  [C 0805_L]
C30  0805  value 100nF  [C 0805_M]
C86  0805  value 100nF  [C 0805_M]
L2  0805  value 0R  [R 0805_L]
L3  0805  value 0R  [R 0805_L]
L4  0805  value R0  [R 0805_L]
Q1  YJL3400A  [SOT23-3M]
R17  0805  value 4.7k  [R 0805_L]
R18  0805  value 4.7k  [R 0805_L]
R19  0805  value 430R  [R 0805_L]
R20  0805  value 430R  [R 0805_L]
R21  0805  value 430R  [R 0805_L]
R22  0805  value 430R  [R 0805_L]
R23  0805  value 430R  [R 0805_L]
R24  0805  value 430R  [R 0805_L]
R25  0805  value 430R  [R 0805_L]
R26  0805  value 430R  [R 0805_L]
R27  0805  value 430R  [R 0805_L]
R28  0805  value 430R  [R 0805_L]
R29  0805  value 120R  [R 0805_L]
R30  0805  value 10K  [R 0805_L]
R31  0805  value 33.0R  [R 0805_L]
R87  0805  value 4.7k  [R 0805_L]
R88  0805  value 4.7k  [R 0805_L]
U4  BMI088  [PQFN50P450X300X100-16N]
U5  IST8310  [QFN16]
U10  BMP180  [BMP180]

### Ports
CS1_Accel(PA4) (in), CS1_Gyro(PB0) (in), DRDY_IST8310(PG3) (out), I2C1_SCL(PB8) (in), I2C1_SDA(PB9) (bidir), I2C2_SCL(PH4) (in), I2C2_SDA(PH5) (bidir), INT1_Accel(PC4) (out), INT1_Gyro(PC5) (out), RSTN_IST8310(PG6) (in), SPI1_CLK(PB3) (in), SPI1_MISO(PB4) (out), SPI1_MOSI(PA7) (in), TIM12_CH2(PH9) (in)

### Nets
GND: C20.1 C21.1 C22.2 C23.1 C24.1 C25.1 C26.2 C27.1 C28.1 C86.2 L4.1 U4.4(GNDA) U4.6(GNDIO) U4.7(PS) U5.9(GND1) U5.11(GND2) U10.7(GND)
PGND_H: C29.1 C30.1 L4.2 Q1.2(S) R30.1
VCC_3V3: L2.1
VCC_3V3_IMU: C20.2 C21.2 C22.1 C23.2 C24.2 C25.2 C27.2 C86.1 L2.2 R17.2 R18.2 R87.2 R88.2 U4.3(VDD) U4.11(VDDIO) U5.2(AVDD) U5.13(DVDD) U10.2(VDD) U10.3(VDDIO)
VCC_5V_M: C28.2 L3.1
VCC_5V_M_HEAT: C29.2 C30.2 L3.2 R19.2 R20.2 R21.2 R22.2 R23.2 R24.2 R25.2 R26.2 R27.2 R28.2
PB4: R31.1 ; port SPI1_MISO(PB4)
PB8: R17.1 U5.1(SCL) ; port I2C1_SCL(PB8)
PB9: R18.1 U5.16(SDA) ; port I2C1_SDA(PB9)
PC4: U4.16(INT1) ; port INT1_Accel(PC4)
PC5: U4.12(INT3) ; port INT1_Gyro(PC5)
PG3: U5.15(DRDY) ; port DRDY_IST8310(PG3)
PG6: U5.14(RSTN) ; port RSTN_IST8310(PG6)
PH4: R88.1 U10.5(SCL) ; port I2C2_SCL(PH4)
PH5: R87.1 U10.6(SDA) ; port I2C2_SDA(PH5)
PH9: R29.1 ; port TIM12_CH2(PH9)
NetC26_1: C26.1 U5.10(C1)
NetQ1_1: Q1.1(G) R29.2 R30.2
NetQ1_3: Q1.3(D) R19.1 R20.1 R21.1 R22.1 R23.1 R24.1 R25.1 R26.1 R27.1 R28.1
NetR31_2: R31.2 U4.10(SDO2) U4.15(SDO1)
NetR36_2: U4.5(CSB2) ; port CS1_Gyro(PB0)
NetR37_2: U4.8(SCL/SCK) ; port SPI1_CLK(PB3)
NetR38_1: U4.14(CSB1) ; port CS1_Accel(PA4)
NetR39_1: U4.9(SDA/SDI) ; port SPI1_MOSI(PA7)

Not connected (* = marked no-connect by the designer): U4 1(INT2)* 13(INT4)*; U5 3(NC1)* 4(NC2)* 5(CAD0)* 6(CAD1)* 7(VPP)* 8(NC3)* 12(NC)*

### Notes on the sheet
- (near U4) PS：0-SPI，1-IIC
- Accel Gyro
- Magnetometer
- (near U5) 2mm内不放置器件
- Power_IMU
- Barometer
- Heat

### Library data of the parts
C20-C30 C86 = CAP
L2-L4 R17-R31 R87 R88 = RES2: Resistor; Published: 8-Jun-2000; LatestRevisionDate: 17-Jul-2002; LatestRevisionNote: Re-released for DXP Platform.; PackageReference: AXIAL-0.3; Publisher: Altium Limited; PackageDescription: Axial Device, Thru-Hole; 2 Leads; 0.3 in Pin Spacing
Q1 = MOSFET N
U4 = BMI088: Accelerometer, Gyroscope, 6 Axis Sensor IÂ²C, SPI Output; MF: Bosch Sensortec; Availability: Unavailable; MP: BMI088; Price: None; Value: *; SnapEDA_Link: https://www.snapeda.com/parts/BMI088/Bosch%20Sensortec/view-part/2774026/?ref=snap; Package: VFLGA-16 Bosch Sensortec
U10 = BMP180: Pressure Sensor 4.35PSI ~ 15.95PSI _30kPa ~ 110kPa_ Absolute 16 ~ 19 b 7-VLGA; MF: Bosch Sensortec; Digi-Key_Purchase_URL: https://www.digikey.com/product-detail/en/bosch-sensortec/BMP180/828-1027-1-ND/2688260?utm_source=snapeda&utm_medium=aggregator&utm_campaign=symbol; Digi-Key_Part_Number: 828-1027-1-ND; Package: VLGA-7 Bosch Sensortec; SnapEDA_Link: https://www.snapeda.com/parts/BMP180/Bosch%20Sensortec/view-part/587596/?ref=snap; Value: *; MP: BMP180

## Sheet Interface2.SchDoc
size A4
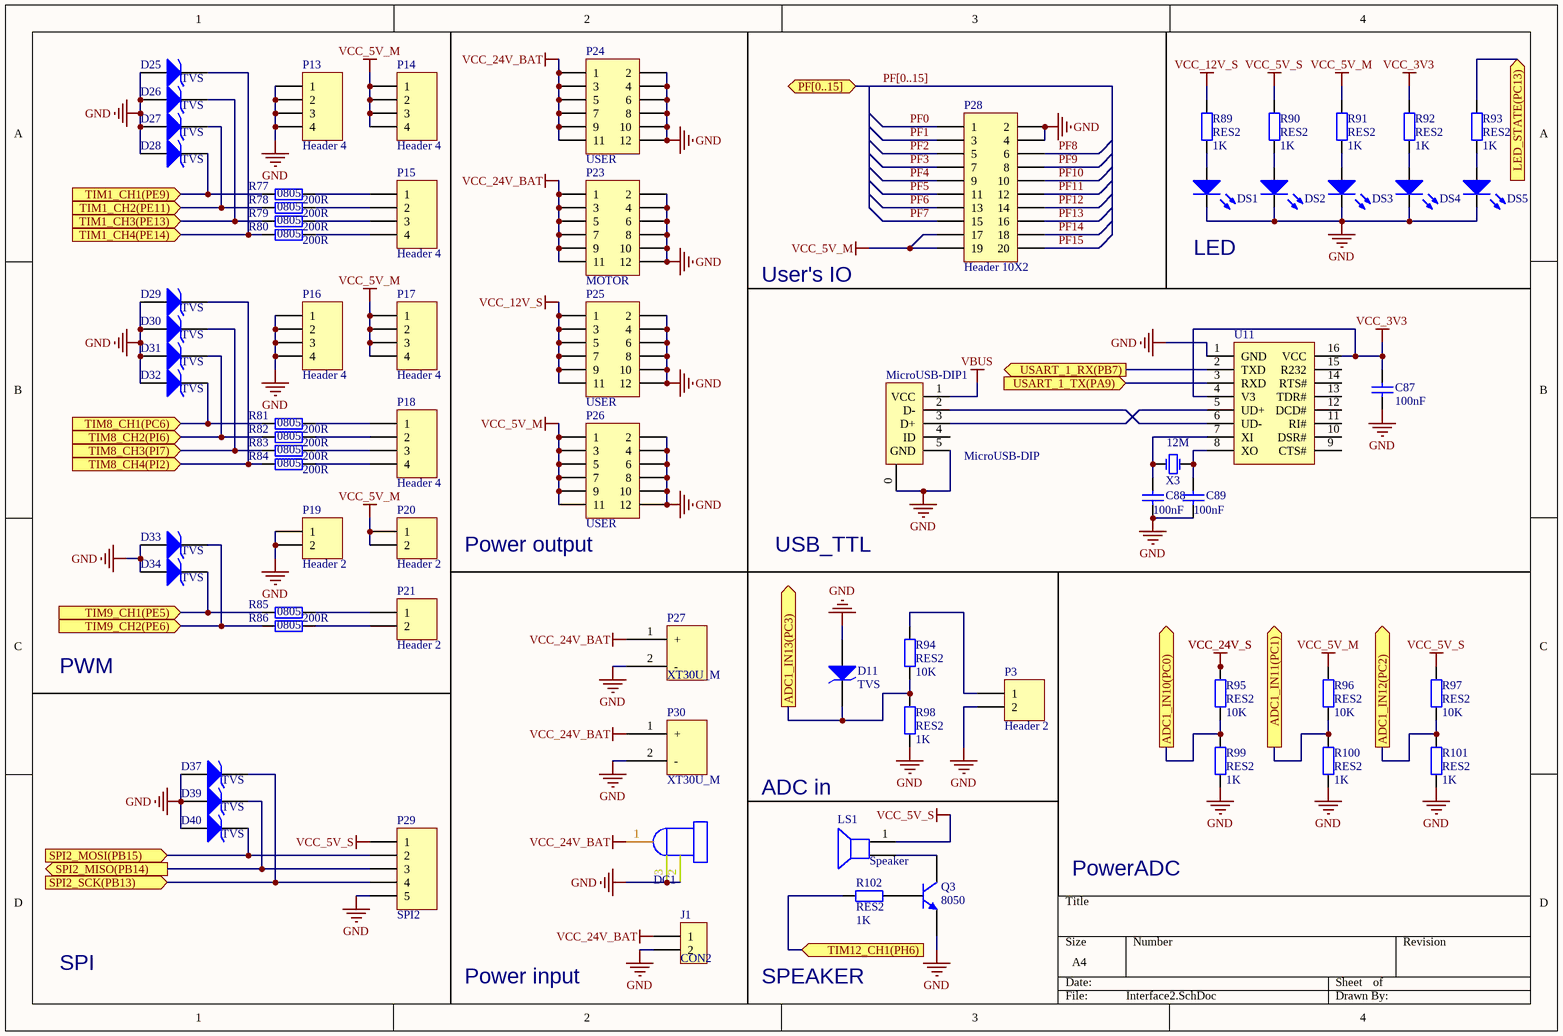
[diagram p4: Interface2.SchDoc]

### Parts
C87  value 100nF  [C 0805_L]  (hidden comment: CAP)
C88  value 100nF  [C 0805_L]  (hidden comment: CAP)
C89  value 100nF  [C 0805_L]  (hidden comment: CAP)
D11  TVS  [SOD-523]
D25  TVS  [SOD-523]
D26  TVS  [SOD-523]
D27  TVS  [SOD-523]
D28  TVS  [SOD-523]
D29  TVS  [SOD-523]
D30  TVS  [SOD-523]
D31  TVS  [SOD-523]
D32  TVS  [SOD-523]
D33  TVS  [SOD-523]
D34  TVS  [SOD-523]
D37  TVS  [SOD-523]
D39  TVS  [SOD-523]
D40  TVS  [SOD-523]
DC1  DC  [DC-005]  (value not drawn)
DS1  LED  [LED 0805B]  (value not drawn)
DS2  LED  [LED 0805B]  (value not drawn)
DS3  LED  [LED 0805B]  (value not drawn)
DS4  LED  [LED 0805B]  (value not drawn)
DS5  LED  [LED 0805B]  (value not drawn)
J1  CON2  [DG1282-5.0]
LS1  Speaker  [BEEP 5x9x5.5]
MicroUSB-DIP1  MicroUSB-DIP  [MICRO_USB_DIP]
P3  Header 2  [HDR2.54-LI-2P]
P13  Header 4  [HDR2.54-LI-4P]
P14  Header 4  [HDR2.54-LI-4P]
P15  Header 4  [HDR2.54-LI-4P]
P16  Header 4  [HDR2.54-LI-4P]
P17  Header 4  [HDR2.54-LI-4P]
P18  Header 4  [HDR2.54-LI-4P]
P19  Header 2  [HDR2.54-LI-2P]
P20  Header 2  [HDR2.54-LI-2P]
P21  Header 2  [HDR2.54-LI-2P]
P23  MOTOR  [HDR2.54-LI-2x6P]
P24  USER  [HDR2.54-LI-2x6P]
P25  USER  [HDR2.54-LI-2x6P]
P26  USER  [HDR2.54-LI-2x6P]
P27  XT30U_M  [XT30U-M]
P28  Header 10X2  [HDR10X2_A1]
P29  SPI2  [HDR2.54-LI-5P]
P30  XT30U_M  [XT30U-M]
Q3  8050  [SOT23-3L]
R77  0805  value 200R  [R 0805_L]
R78  0805  value 200R  [R 0805_L]
R79  0805  value 200R  [R 0805_L]
R80  0805  value 200R  [R 0805_L]
R81  0805  value 200R  [R 0805_L]
R82  0805  value 200R  [R 0805_L]
R83  0805  value 200R  [R 0805_L]
R84  0805  value 200R  [R 0805_L]
R85  0805  value 200R  [R 0805_L]
R86  0805  [R 0805_L]
R89  RES2  value 1K  [R 0805_L]
R90  RES2  value 1K  [R 0805_L]
R91  RES2  value 1K  [R 0805_L]
R92  RES2  value 1K  [R 0805_L]
R93  RES2  value 1K  [R 0805_L]
R94  RES2  value 10K  [R 0805_L]
R95  RES2  value 10K  [R 0805_L]
R96  RES2  value 10K  [R 0805_L]
R97  RES2  value 10K  [R 0805_L]
R98  RES2  value 1K  [R 0805_L]
R99  RES2  value 1K  [R 0805_L]
R100  RES2  value 1K  [R 0805_L]
R101  RES2  value 1K  [R 0805_L]
R102  RES2  value 1K  [R 0805_L]
U11  CH340G  [SOP16_M]  (value not drawn)
X3  12M  [OSC HC-49S]

### Ports
ADC1_IN10(PC0) (out), ADC1_IN11(PC1) (out), ADC1_IN12(PC2) (out), ADC1_IN13(PC3) (out), LED_STATE(PC13) (in), PF[0..15] (bidir), SPI2_MISO(PB14) (out), SPI2_MOSI(PB15) (in), SPI2_SCK(PB13) (in), TIM1_CH1(PE9) (in), TIM1_CH2(PE11) (in), TIM1_CH3(PE13) (in), TIM1_CH4(PE14) (in), TIM8_CH1(PC6) (in), TIM8_CH2(PI6) (in), TIM8_CH3(PI7) (in), TIM8_CH4(PI2) (in), TIM9_CH1(PE5) (in), TIM9_CH2(PE6) (in), TIM12_CH1(PH6) (in), USART_1_RX(PB7) (out), USART_1_TX(PA9) (in)

### Nets
GND: C87.1 C88.1 C89.1 D11.1(A) D25.1(A) D26.1(A) D27.1(A) D28.1(A) D29.1(A) D30.1(A) D31.1(A) D32.1(A) D33.1(A) D34.1(A) D37.1(A) D39.1(A) D40.1(A) DC1.2(-) DC1.3(-) DS1.2(K) DS2.2(K) DS3.2(K) DS4.2(K) DS5.2(K) J1.2 MicroUSB-DIP1.0 MicroUSB-DIP1.5(GND) P3.2 P13.1 P13.2 P13.3 P13.4 P16.1 P16.2 P16.3 P16.4 P19.1 P19.2 P23.2 P23.4 P23.6 P23.8 P23.10 P23.12 P24.2 P24.4 P24.6 P24.8 P24.10 P24.12 P25.2 P25.4 P25.6 P25.8 P25.10 P25.12 P26.2 P26.4 P26.6 P26.8 P26.10 P26.12 P27.2(-) P28.2 P28.4 P29.5 P30.2(-) Q3.2(E) R98.1 R99.1 R100.1 R101.1 U11.1(GND)
VBUS: MicroUSB-DIP1.1(VCC)
VCC_3V3: C87.2 R92.2 U11.4(V3) U11.16(VCC)
VCC_5V_M: P14.1 P14.2 P14.3 P14.4 P17.1 P17.2 P17.3 P17.4 P20.1 P20.2 P26.1 P26.3 P26.5 P26.7 P26.9 P26.11 P28.17 P28.19 R91.2 R96.2
VCC_5V_S: LS1.1 P29.1 R90.2 R97.2
VCC_12V_S: P25.1 P25.3 P25.5 P25.7 P25.9 P25.11 R89.2
VCC_24V_BAT: DC1.1(+) J1.1 P23.1 P23.3 P23.5 P23.7 P23.9 P23.11 P24.1 P24.3 P24.5 P24.7 P24.9 P24.11 P27.1(+) P30.1(+)
VCC_24V_S: R95.2
PA9: U11.3(RXD) ; port USART_1_TX(PA9)
PB7: U11.2(TXD) ; port USART_1_RX(PB7)
PB13: D37.2(K) P29.4 ; port SPI2_SCK(PB13)
PB14: D39.2(K) P29.3 ; port SPI2_MISO(PB14)
PB15: D40.2(K) P29.2 ; port SPI2_MOSI(PB15)
PC0: R95.1 R99.2 ; port ADC1_IN10(PC0)
PC1: R96.1 R100.2 ; port ADC1_IN11(PC1)
PC2: R97.1 R101.2 ; port ADC1_IN12(PC2)
PC3: D11.2(K) R94.1 R98.2 ; port ADC1_IN13(PC3)
PC6: D32.2(K) R81.1 ; port TIM8_CH1(PC6)
PC13: R93.2 ; port LED_STATE(PC13)
PE5: D34.2(K) R85.1 ; port TIM9_CH1(PE5)
PE6: D33.2(K) R86.1 ; port TIM9_CH2(PE6)
PE9: D28.2(K) R77.1 ; port TIM1_CH1(PE9)
PE11: D27.2(K) R78.1 ; port TIM1_CH2(PE11)
PE13: D26.2(K) R79.1 ; port TIM1_CH3(PE13)
PE14: D25.2(K) R80.1 ; port TIM1_CH4(PE14)
PF0: P28.1
PF1: P28.3
PF2: P28.5
PF3: P28.7
PF4: P28.9
PF5: P28.11
PF6: P28.13
PF7: P28.15
PF8: P28.6
PF9: P28.8
PF10: P28.10
PF11: P28.12
PF12: P28.14
PF13: P28.16
PF14: P28.18
PF15: P28.20
PH6: R102.2 ; port TIM12_CH1(PH6)
PI2: D29.2(K) R84.1 ; port TIM8_CH4(PI2)
PI6: D31.2(K) R82.1 ; port TIM8_CH2(PI6)
PI7: D30.2(K) R83.1 ; port TIM8_CH3(PI7)
NetC88_2: C88.2 U11.7(XI) X3.1(OSC1)
NetC89_2: C89.2 U11.8(XO) X3.2(OSC2)
NetDS1_1: DS1.1(A) R89.1
NetDS2_1: DS2.1(A) R90.1
NetDS3_1: DS3.1(A) R91.1
NetDS4_1: DS4.1(A) R92.1
NetDS5_1: DS5.1(A) R93.1
NetLS1_2: LS1.2 Q3.3(C)
NetMicroUSB-DIP1_2: MicroUSB-DIP1.2(D-) U11.6(UD-)
NetMicroUSB-DIP1_3: MicroUSB-DIP1.3(D+) U11.5(UD+)
NetP3_1: P3.1 R94.2
NetP15_1: P15.1 R77.2
NetP15_2: P15.2 R78.2
NetP15_3: P15.3 R79.2
NetP15_4: P15.4 R80.2
NetP18_1: P18.1 R81.2
NetP18_2: P18.2 R82.2
NetP18_3: P18.3 R83.2
NetP18_4: P18.4 R84.2
NetP21_1: P21.1 R85.2
NetP21_2: P21.2 R86.2
NetQ3_1: Q3.1(B) R102.1

Not connected (* = marked no-connect by the designer): MicroUSB-DIP1 4(ID); U11 9(CTS#) 10(DSR#) 11(RI#) 12(DCD#) 13(TDR#) 14(RTS#) 15(R232)

### Buses and harness runs
bus PF[0..15] = port PF[0..15]

### Notes on the sheet
- User's IO
- LED
- (near P26) Power output
- USB_TTL
- PWM
- ADC in
- PowerADC
- SPI
- Power input
- SPEAKER

### Library data of the parts
D11 D25-D34 D37 D39 D40 = D: High Conductance Fast Diode; Published: 8-Jun-2000; LatestRevisionDate: 17-Jul-2002; LatestRevisionNote: Re-released for DXP Platform.; DatasheetVersion: 1997; PackageReference: DO-35; Publisher: Altium Limited; PackageDescription: Diode, Axial; Body 3.8 x 1.9 mm (LxDia. max), Lead Dia. 0.53 mm (max); Code_JEDEC: DO-204-AH; ComponentLink1Description: Manufacturer Link; ComponentLink1URL: http://www.fairchildsemi.com/; ComponentLink2Description: Datasheet; ComponentLink2URL: http://www.fairchildsemi.com/ds/1N%2F1N4148.pdf
LS1 = Speaker: Loudspeaker; Published: 24-Mar-1999; LatestRevisionDate: 17-Jul-2002; LatestRevisionNote: Re-released for DXP Platform.; PackageReference: PIN2; Publisher: Altium Limited
P3 P19-P21 = Header 2: Header, 2-Pin; LatestRevisionDate: 17-Jul-2002; LatestRevisionNote: Re-released for DXP Platform.; Publisher: Altium Limited
P13-P18 = Header 4: Header, 4-Pin; LatestRevisionDate: 17-Jul-2002; LatestRevisionNote: Re-released for DXP Platform.; Publisher: Altium Limited
P23-P26 = Header 6X2: Header, 6-Pin, Dual row; LatestRevisionDate: 17-Jul-2002; LatestRevisionNote: Re-released for DXP Platform.; Publisher: Altium Limited
P28 = Header 10X2: Header, 10-Pin; LatestRevisionDate: 17-Jul-2002; LatestRevisionNote: Re-released for DXP Platform.; Publisher: Altium Limited
P29 = Header 5: Header, 5-Pin; LatestRevisionDate: 17-Jul-2002; LatestRevisionNote: Re-released for DXP Platform.; Publisher: Altium Limited
Q3 = NPN  SOT: NPN Bipolar Transistor; Published: 8-Jun-2000; LatestRevisionDate: 17-Jul-2002; LatestRevisionNote: Re-released for DXP Platform.; PackageReference: TO-226-AA; Publisher: Altium Limited; PackageDescription: TO, Flat Index; 3 In-Line, Axial Leads; Body Dia. 4.8mm; Leads 0.55 x 0.51 mm (max); Code_JEDEC: TO-226-AA
R77-R86 R89-R102 = RES2: Resistor; Published: 8-Jun-2000; LatestRevisionDate: 17-Jul-2002; LatestRevisionNote: Re-released for DXP Platform.; PackageReference: AXIAL-0.3; Publisher: Altium Limited; PackageDescription: Axial Device, Thru-Hole; 2 Leads; 0.3 in Pin Spacing
X3 = YX

## Nets that join several sheets
GND: MCU (14 pins), Power (83 pins), Interface1 (52 pins), Sensor (17 pins), Interface2 (73 pins)
VBUS: Power (D6.1), Interface1 (USBC1.A4 USBC1.A9 USBC1.B4 USBC1.B9), Interface2 (MicroUSB-DIP1.1)
VCC_3V3: MCU (R4.1 R34.1 R35.2 R42.1), Power (8 pins), Interface1 (7 pins), Sensor (L2.1), Interface2 (C87.2 R92.2 U11.4 U11.16)
VCC_5V_M: Power (8 pins), Interface1 (P6.1 P11.1), Sensor (C28.2 L3.1), Interface2 (20 pins)
VCC_5V_S: Power (13 pins), Interface1 (19 pins), Interface2 (LS1.1 P29.1 R90.2 R97.2)
VCC_12V_S: Power (5 pins), Interface2 (7 pins)
VCC_24V_BAT: Power (5 pins), Interface2 (16 pins)
VCC_24V_S: Power (16 pins), Interface2 (R95.2)
CC: MCU (U1.121), Interface1 (USBC1.A5 USBC1.B5)
NetR36_2: MCU (R36.2), Sensor (U4.5)
NetR37_2: MCU (R37.2), Sensor (U4.8)
NetR38_1: MCU (R38.1), Sensor (U4.14)
NetR39_1: MCU (R39.1), Sensor (U4.9)
NetR40_2: MCU (R40.2), Interface1 (U3.1)
NetR41_2: MCU (R41.2), Interface1 (U2.1)
PA0: MCU (U1.40), Interface1 (R60.1)
PA1: MCU (U1.41), Interface1 (R76.1)
PA2: MCU (U1.42), Interface1 (D16.2 P7.2)
PA3: MCU (U1.47), Interface1 (D15.2 P7.3)
PA5: MCU (U1.51), Interface1 (R75.1)
PA6: MCU (U1.52), Interface1 (R70.1)
PA9: MCU (U1.120), Interface2 (U11.3)
PA11: MCU (U1.122), Interface1 (R10.1)
PA12: MCU (U1.123), Interface1 (R11.1)
PA13: MCU (U1.124), Interface1 (R13.1)
PA14: MCU (U1.137), Interface1 (R14.1)
PB4: MCU (U1.162), Sensor (R31.1)
PB5: MCU (U1.163), Interface1 (U3.4)
PB7: MCU (U1.165), Interface2 (U11.2)
PB8: MCU (U1.167), Sensor (R17.1 U5.1)
PB9: MCU (U1.168), Sensor (R18.1 U5.16)
PB10: MCU (U1.79), Interface1 (D20.2 P9.2)
PB11: MCU (U1.80), Interface1 (D19.2 P9.3)
PB13: MCU (U1.93), Interface2 (D37.2 P29.4)
PB14: MCU (U1.94), Interface2 (D39.2 P29.3)
PB15: MCU (U1.95), Interface2 (D40.2 P29.2)
PC0: MCU (U1.32), Interface2 (R95.1 R99.2)
PC1: MCU (U1.33), Interface2 (R96.1 R100.2)
PC2: MCU (U1.34), Interface2 (R97.1 R101.2)
PC3: MCU (U1.35), Interface2 (D11.2 R94.1 R98.2)
PC4: MCU (U1.54), Sensor (U4.16)
PC5: MCU (U1.55), Sensor (U4.12)
PC6: MCU (U1.115), Interface2 (D32.2 R81.1)
PC7: MCU (U1.116), Interface1 (R71.1)
PC8: MCU (U1.117), Interface1 (SD1.7)
PC9: MCU (U1.118), Interface1 (SD1.8)
PC10: MCU (U1.139), Interface1 (SD1.1)
PC11: MCU (U1.140), Interface1 (SD1.2)
PC12: MCU (U1.141), Interface1 (SD1.5)
PC13: MCU (U1.8), Interface2 (R93.2)
PD0: MCU (U1.142), Interface1 (U2.4)
PD2: MCU (U1.144), Interface1 (SD1.3)
PD12: MCU (U1.100), Interface1 (R65.1)
PD13: MCU (U1.101), Interface1 (R66.1)
PE5: MCU (U1.4), Interface2 (D34.2 R85.1)
PE6: MCU (U1.5), Interface2 (D33.2 R86.1)
PE9: MCU (U1.70), Interface2 (D28.2 R77.1)
PE11: MCU (U1.74), Interface2 (D27.2 R78.1)
PE13: MCU (U1.76), Interface2 (D26.2 R79.1)
PE14: MCU (U1.77), Interface2 (D25.2 R80.1)
PE15: MCU (U1.78), Interface1 (R8.1)
PF0: MCU (U1.16), Interface2 (P28.1)
PF1: MCU (U1.17), Interface2 (P28.3)
PF2: MCU (U1.18), Interface2 (P28.5)
PF3: MCU (U1.19), Interface2 (P28.7)
PF4: MCU (U1.20), Interface2 (P28.9)
PF5: MCU (U1.21), Interface2 (P28.11)
PF6: MCU (U1.24), Interface2 (P28.13)
PF7: MCU (U1.25), Interface2 (P28.15)
PF8: MCU (U1.26), Interface2 (P28.6)
PF9: MCU (U1.27), Interface2 (P28.8)
PF10: MCU (U1.28), Interface2 (P28.10)
PF11: MCU (U1.59), Interface2 (P28.12)
PF12: MCU (U1.60), Interface2 (P28.14)
PF13: MCU (U1.63), Interface2 (P28.16)
PF14: MCU (U1.64), Interface2 (P28.18)
PF15: MCU (U1.65), Interface2 (P28.20)
PG3: MCU (U1.107), Sensor (U5.15)
PG6: MCU (U1.110), Sensor (U5.14)
PG9: MCU (U1.152), Interface1 (D35.2 P22.3)
PG14: MCU (U1.157), Interface1 (D36.2 P22.2)
PH4: MCU (U1.45), Sensor (R88.1 U10.5)
PH5: MCU (U1.46), Sensor (R87.1 U10.6)
PH6: MCU (U1.83), Interface2 (R102.2)
PH9: MCU (U1.86), Sensor (R29.1)
PH11: MCU (U1.88), Interface1 (R61.1)
PI2: MCU (U1.133), Interface2 (D29.2 R84.1)
PI6: MCU (U1.175), Interface2 (D31.2 R82.1)
PI7: MCU (U1.176), Interface2 (D30.2 R83.1)